# EAGLE schematic 7SEG_STATUS_1 (EAGLE 6.5.0)

## Sheet 1 of 9
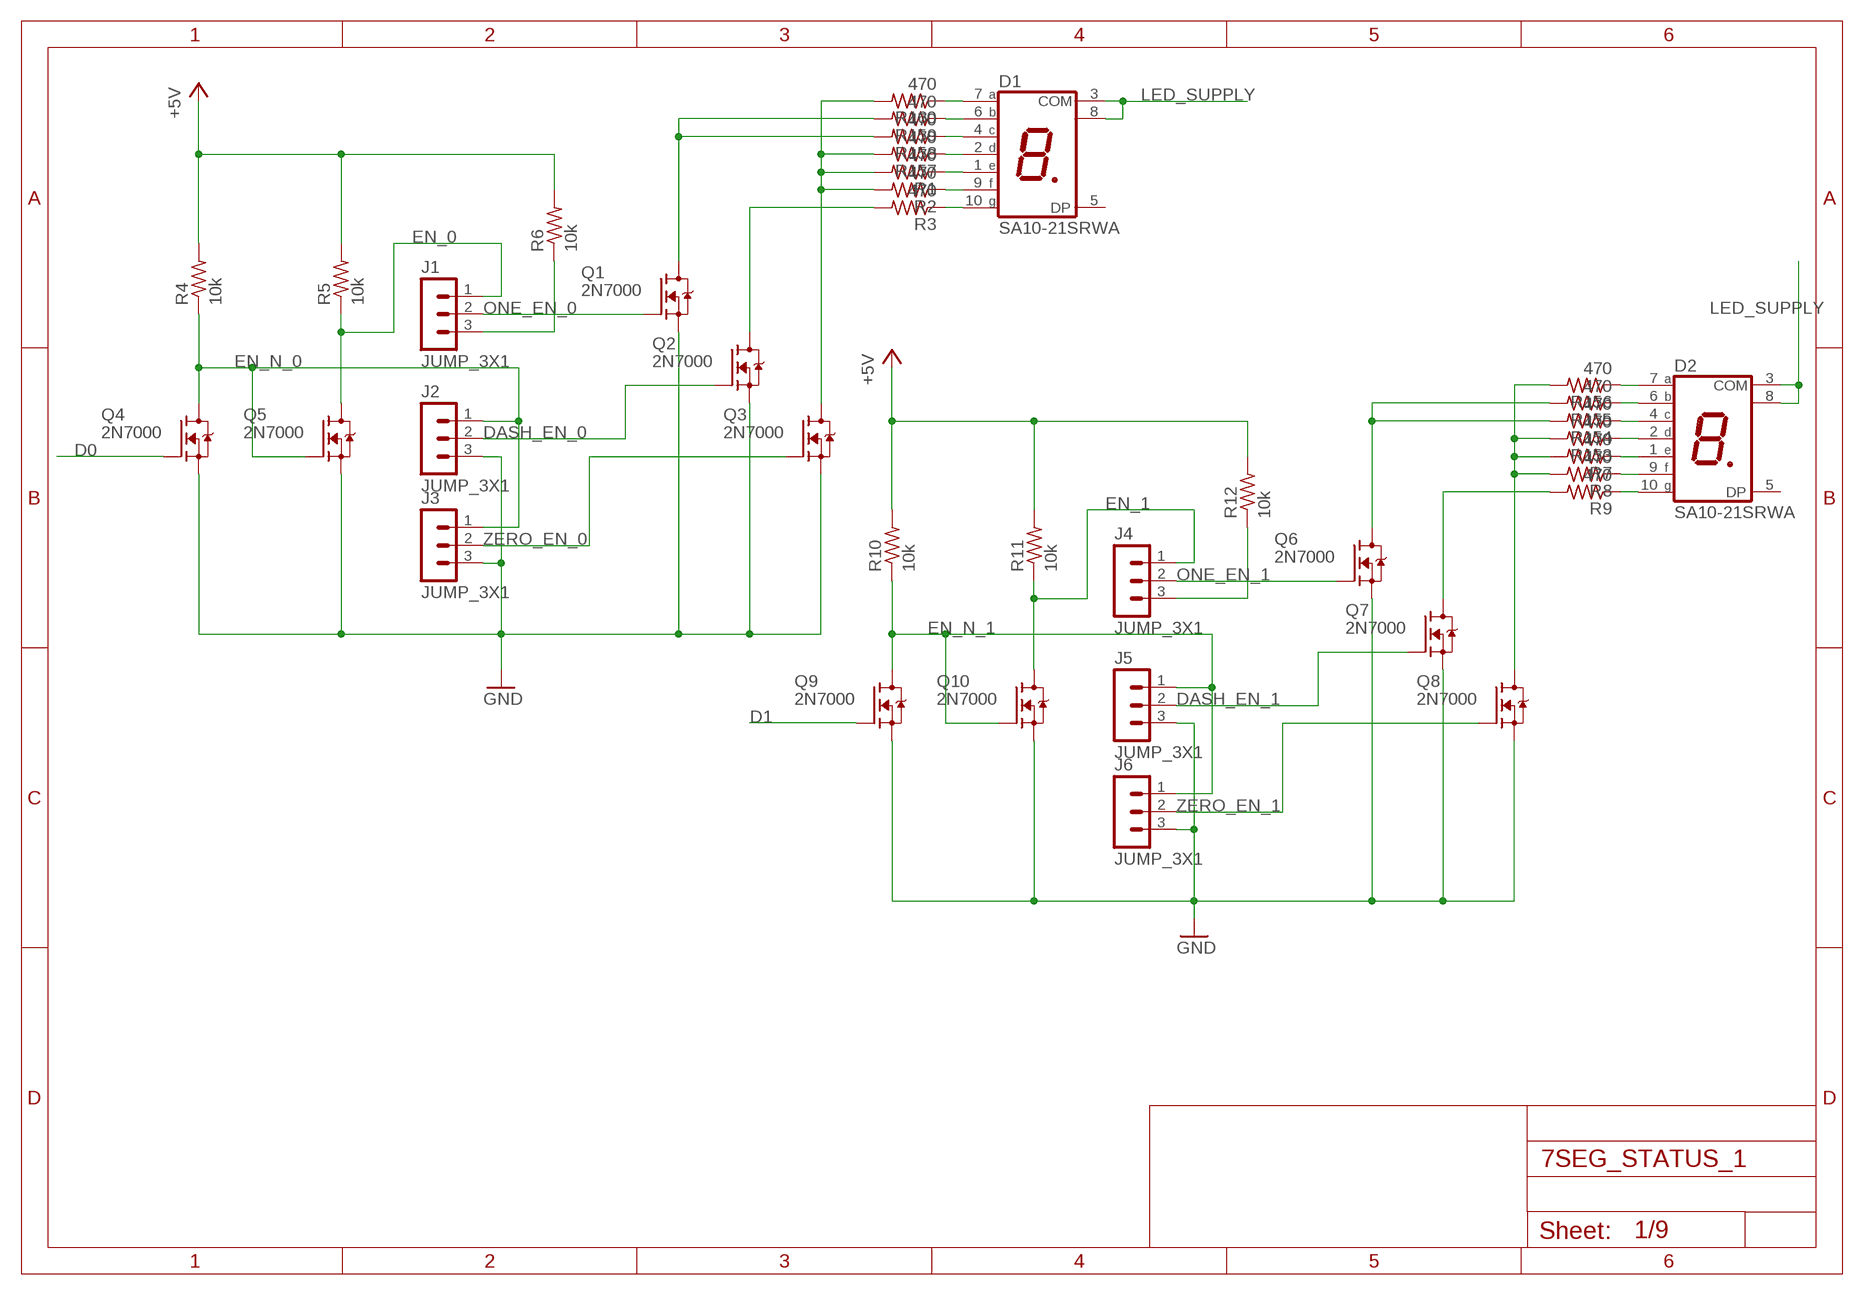
[diagram p0: schematic, sheet 1]

### Parts
D1  SA10-21SRWA  [SA10]
D2  SA10-21SRWA  [SA10]
J1  JUMP_3X1  [JUMP_3X1]
J2  JUMP_3X1  [JUMP_3X1]
J3  JUMP_3X1  [JUMP_3X1]
J4  JUMP_3X1  [JUMP_3X1]
J5  JUMP_3X1  [JUMP_3X1]
J6  JUMP_3X1  [JUMP_3X1]
Q1  2N7000  [TO92-DGS]
Q2  2N7000  [TO92-DGS]
Q3  2N7000  [TO92-DGS]
Q4  2N7000  [TO92-DGS]
Q5  2N7000  [TO92-DGS]
Q6  2N7000  [TO92-DGS]
Q7  2N7000  [TO92-DGS]
Q8  2N7000  [TO92-DGS]
Q9  2N7000  [TO92-DGS]
Q10  2N7000  [TO92-DGS]
R1  470  R_P2INCH  [R_P2INCH]
R2  470  R_P2INCH  [R_P2INCH]
R3  470  R_P2INCH  [R_P2INCH]
R4  10k  R_P2INCH  [R_P2INCH]
R5  10k  R_P2INCH  [R_P2INCH]
R6  10k  R_P2INCH  [R_P2INCH]
R7  470  R_P2INCH  [R_P2INCH]
R8  470  R_P2INCH  [R_P2INCH]
R9  470  R_P2INCH  [R_P2INCH]
R10  10k  R_P2INCH  [R_P2INCH]
R11  10k  R_P2INCH  [R_P2INCH]
R12  10k  R_P2INCH  [R_P2INCH]
R153  470  R_P2INCH  [R_P2INCH]
R154  470  R_P2INCH  [R_P2INCH]
R155  470  R_P2INCH  [R_P2INCH]
R156  470  R_P2INCH  [R_P2INCH]
R157  470  R_P2INCH  [R_P2INCH]
R158  470  R_P2INCH  [R_P2INCH]
R159  470  R_P2INCH  [R_P2INCH]
R160  470  R_P2INCH  [R_P2INCH]

### Nets
+5V: R4.2 R5.2 R6.2 R10.2 R11.2 R12.2 ; also sheet 2,3,4,5,6,7,8,9
D0: Q4.G ; also sheet 9
D1: Q9.G ; also sheet 9
DASH_EN_0: J2.2 Q2.G
DASH_EN_1: J5.2 Q7.G
EN_0: J1.1 Q5.D R5.1
EN_1: J4.1 Q10.D R11.1
EN_N_0: J2.1 J3.1 Q4.D Q5.G R4.1
EN_N_1: J5.1 J6.1 Q9.D Q10.G R10.1
GND: J2.3 J3.3 J5.3 J6.3 Q1.S Q2.S Q3.S Q4.S Q5.S Q6.S Q7.S Q8.S Q9.S Q10.S ; also sheet 2,3,4,5,6,7,8,9
LED_SUPPLY: D1.3(COM) D1.8(COM) D2.3(COM) D2.8(COM) ; also sheet 2,3,4,5,6,7,8,9
N$1: D2.7(A) R156.1
N$3: D2.6(B) R155.1
N$4: D2.4(C) R154.1
N$5: D2.2(D) R153.1
N$6: D1.7(A) R160.1
N$7: D2.1(E) R7.1
N$8: D2.9(F) R8.1
N$9: J4.3 R12.1
N$10: J1.3 R6.1
N$11: D2.10(G) R9.1
N$166: Q7.D R9.2
N$167: Q6.D R154.2 R155.2
N$168: Q8.D R7.2 R8.2 R153.2 R156.2
N$169: D1.6(B) R159.1
N$170: D1.4(C) R158.1
N$171: D1.2(D) R157.1
N$172: D1.1(E) R1.1
N$173: D1.9(F) R2.1
N$174: D1.10(G) R3.1
N$175: Q2.D R3.2
N$176: Q1.D R158.2 R159.2
N$177: Q3.D R1.2 R2.2 R157.2 R160.2
ONE_EN_0: J1.2 Q1.G
ONE_EN_1: J4.2 Q6.G
ZERO_EN_0: J3.2 Q3.G
ZERO_EN_1: J6.2 Q8.G
Unconnected: D1.5(DP) D2.5(DP)

## Sheet 2 of 9
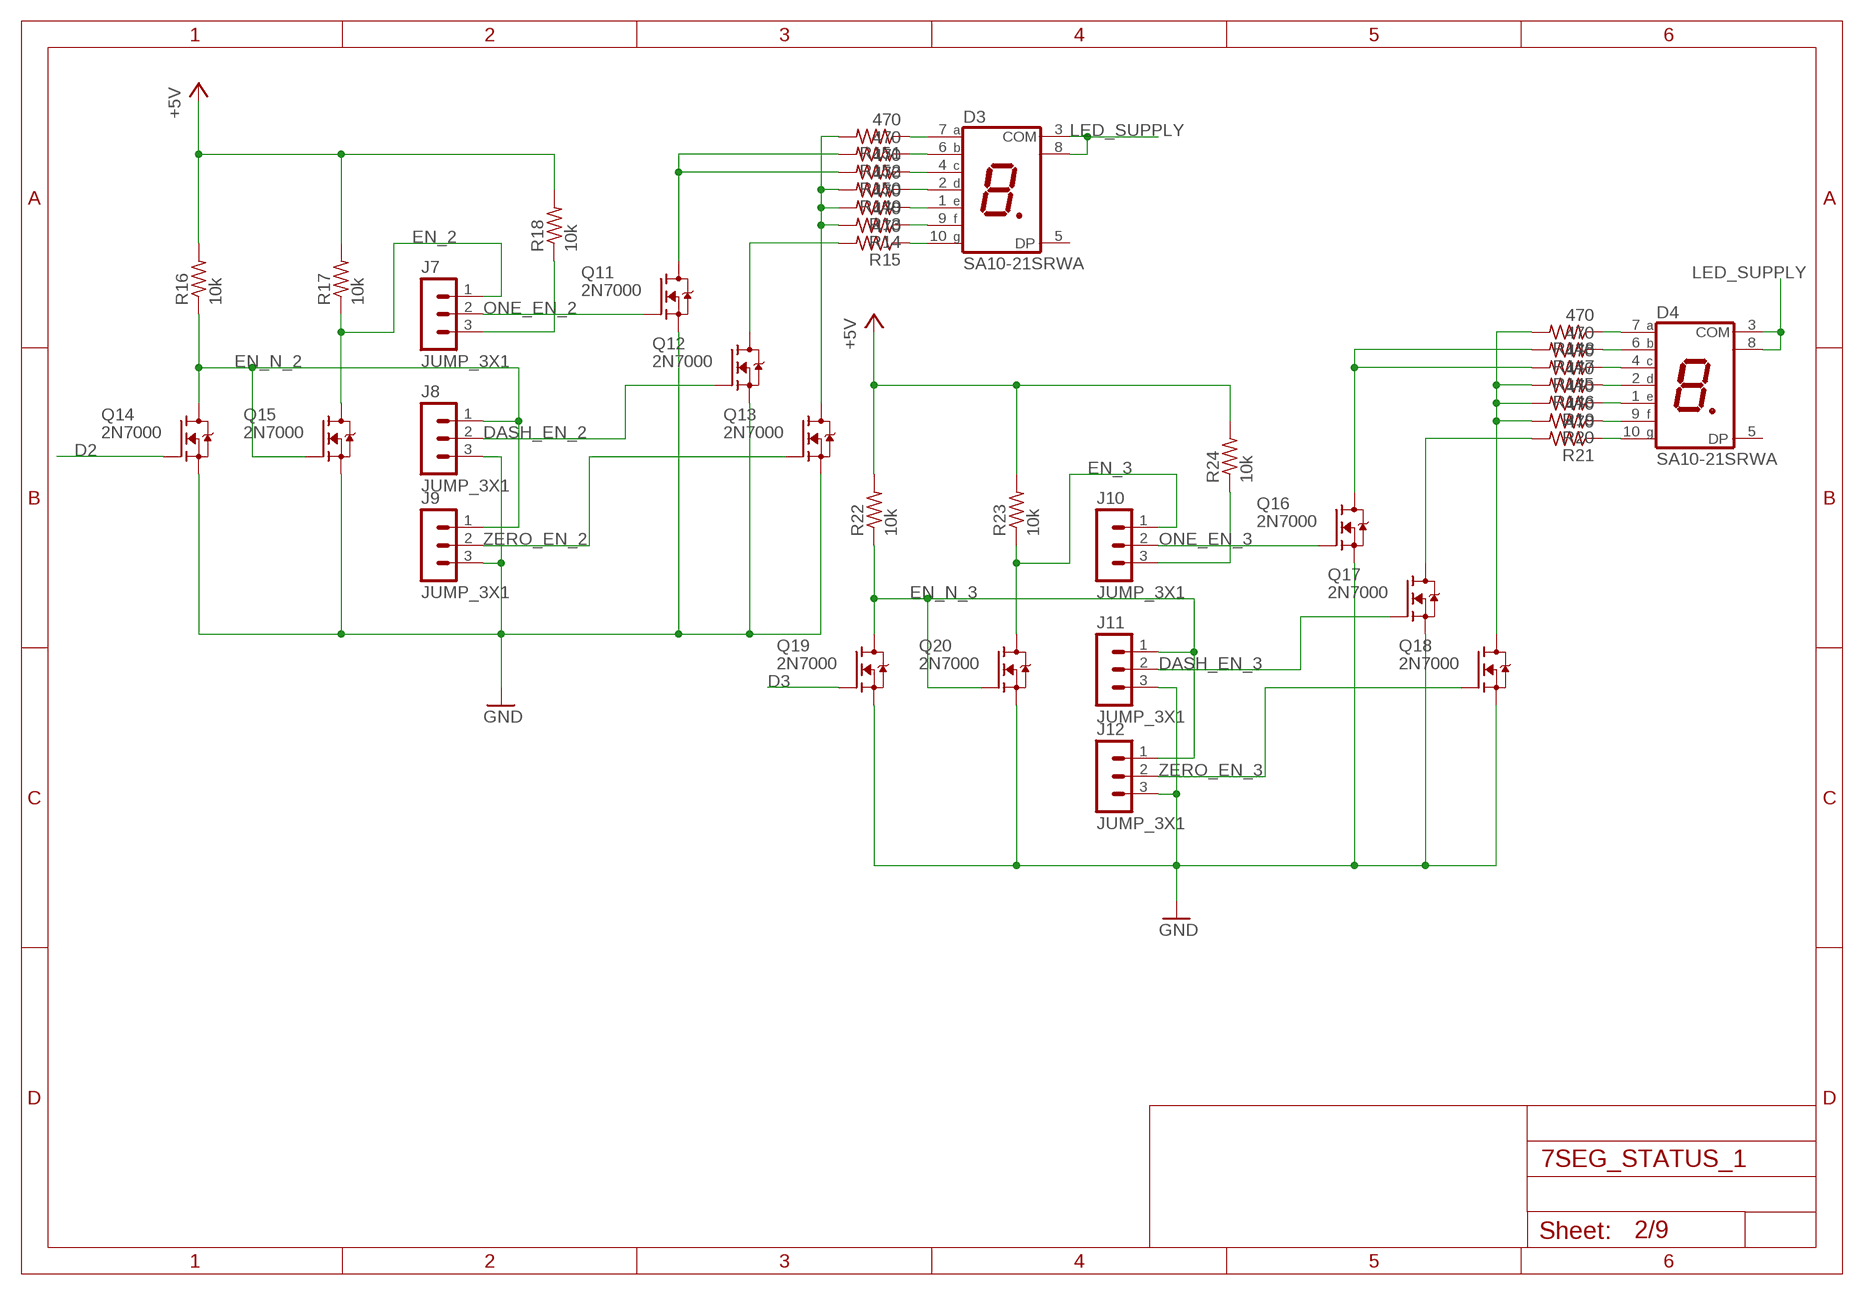
[diagram p1: schematic, sheet 2]

### Parts
D3  SA10-21SRWA  [SA10]
D4  SA10-21SRWA  [SA10]
J7  JUMP_3X1  [JUMP_3X1]
J8  JUMP_3X1  [JUMP_3X1]
J9  JUMP_3X1  [JUMP_3X1]
J10  JUMP_3X1  [JUMP_3X1]
J11  JUMP_3X1  [JUMP_3X1]
J12  JUMP_3X1  [JUMP_3X1]
Q11  2N7000  [TO92-DGS]
Q12  2N7000  [TO92-DGS]
Q13  2N7000  [TO92-DGS]
Q14  2N7000  [TO92-DGS]
Q15  2N7000  [TO92-DGS]
Q16  2N7000  [TO92-DGS]
Q17  2N7000  [TO92-DGS]
Q18  2N7000  [TO92-DGS]
Q19  2N7000  [TO92-DGS]
Q20  2N7000  [TO92-DGS]
R13  470  R_P2INCH  [R_P2INCH]
R14  470  R_P2INCH  [R_P2INCH]
R15  470  R_P2INCH  [R_P2INCH]
R16  10k  R_P2INCH  [R_P2INCH]
R17  10k  R_P2INCH  [R_P2INCH]
R18  10k  R_P2INCH  [R_P2INCH]
R19  470  R_P2INCH  [R_P2INCH]
R20  470  R_P2INCH  [R_P2INCH]
R21  470  R_P2INCH  [R_P2INCH]
R22  10k  R_P2INCH  [R_P2INCH]
R23  10k  R_P2INCH  [R_P2INCH]
R24  10k  R_P2INCH  [R_P2INCH]
R145  470  R_P2INCH  [R_P2INCH]
R146  470  R_P2INCH  [R_P2INCH]
R147  470  R_P2INCH  [R_P2INCH]
R148  470  R_P2INCH  [R_P2INCH]
R149  470  R_P2INCH  [R_P2INCH]
R150  470  R_P2INCH  [R_P2INCH]
R151  470  R_P2INCH  [R_P2INCH]
R152  470  R_P2INCH  [R_P2INCH]

### Nets
+5V: R16.2 R17.2 R18.2 R22.2 R23.2 R24.2 ; also sheet 1,3,4,5,6,7,8,9
D2: Q14.G ; also sheet 9
D3: Q19.G ; also sheet 9
DASH_EN_2: J8.2 Q12.G
DASH_EN_3: J11.2 Q17.G
EN_2: J7.1 Q15.D R17.1
EN_3: J10.1 Q20.D R23.1
EN_N_2: J8.1 J9.1 Q14.D Q15.G R16.1
EN_N_3: J11.1 J12.1 Q19.D Q20.G R22.1
GND: J8.3 J9.3 J11.3 J12.3 Q11.S Q12.S Q13.S Q14.S Q15.S Q16.S Q17.S Q18.S Q19.S Q20.S ; also sheet 1,3,4,5,6,7,8,9
LED_SUPPLY: D3.3(COM) D3.8(COM) D4.3(COM) D4.8(COM) ; also sheet 1,3,4,5,6,7,8,9
N$12: D3.7(A) R151.1
N$13: D4.7(A) R148.1
N$14: D4.6(B) R147.1
N$15: J7.3 R18.1
N$16: D4.4(C) R145.1
N$17: D4.2(D) R146.1
N$18: D4.1(E) R19.1
N$19: D4.9(F) R20.1
N$20: J10.3 R24.1
N$153: D4.10(G) R21.1
N$154: Q17.D R21.2
N$155: Q16.D R145.2 R147.2
N$156: Q18.D R19.2 R20.2 R146.2 R148.2
N$157: D3.6(B) R152.1
N$158: D3.4(C) R150.1
N$159: D3.2(D) R149.1
N$160: D3.1(E) R13.1
N$161: D3.9(F) R14.1
N$162: D3.10(G) R15.1
N$163: Q12.D R15.2
N$164: Q11.D R150.2 R152.2
N$165: Q13.D R13.2 R14.2 R149.2 R151.2
ONE_EN_2: J7.2 Q11.G
ONE_EN_3: J10.2 Q16.G
ZERO_EN_2: J9.2 Q13.G
ZERO_EN_3: J12.2 Q18.G
Unconnected: D3.5(DP) D4.5(DP)

## Sheet 3 of 9
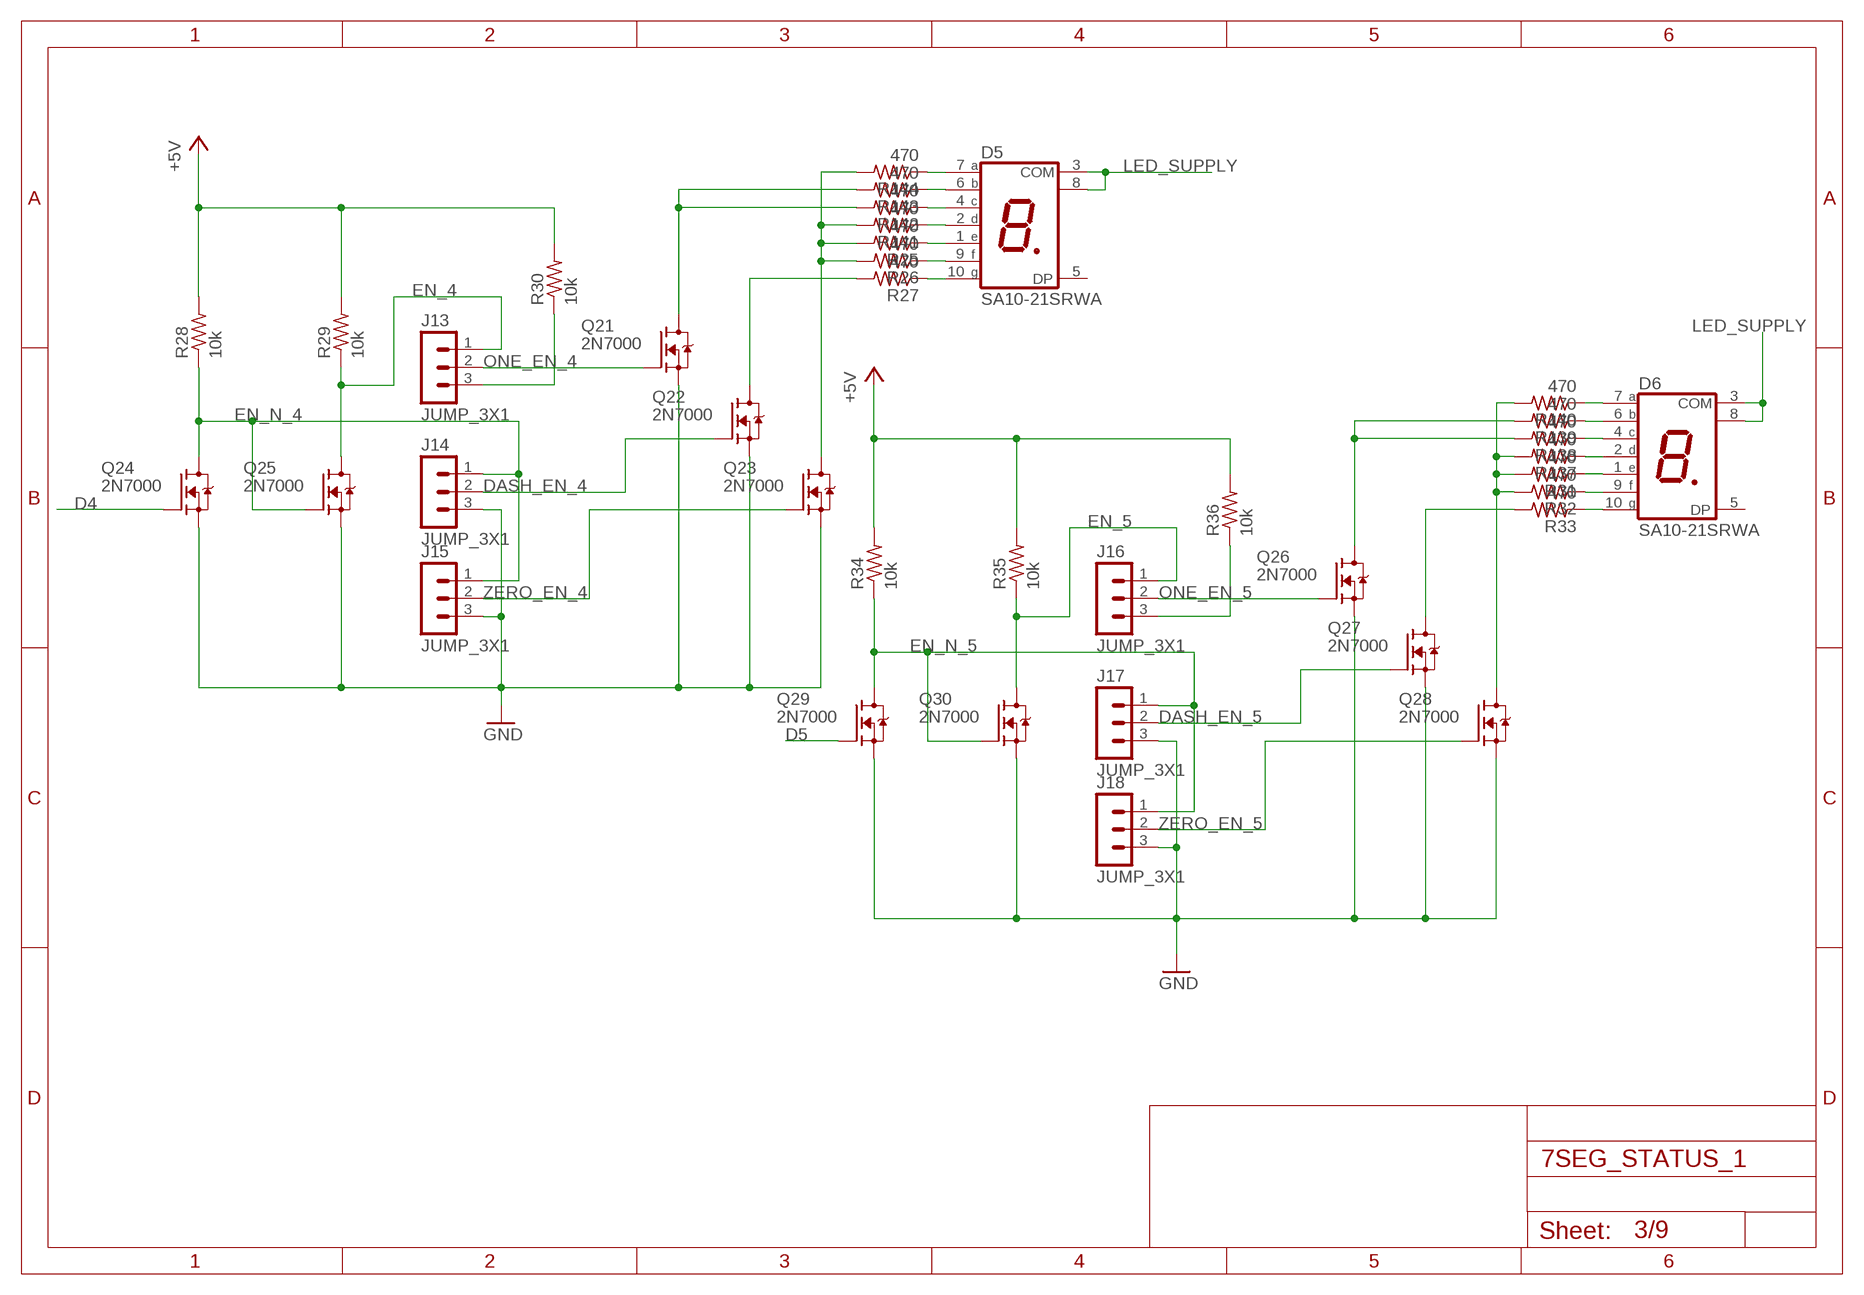
[diagram p2: schematic, sheet 3]

### Parts
D5  SA10-21SRWA  [SA10]
D6  SA10-21SRWA  [SA10]
J13  JUMP_3X1  [JUMP_3X1]
J14  JUMP_3X1  [JUMP_3X1]
J15  JUMP_3X1  [JUMP_3X1]
J16  JUMP_3X1  [JUMP_3X1]
J17  JUMP_3X1  [JUMP_3X1]
J18  JUMP_3X1  [JUMP_3X1]
Q21  2N7000  [TO92-DGS]
Q22  2N7000  [TO92-DGS]
Q23  2N7000  [TO92-DGS]
Q24  2N7000  [TO92-DGS]
Q25  2N7000  [TO92-DGS]
Q26  2N7000  [TO92-DGS]
Q27  2N7000  [TO92-DGS]
Q28  2N7000  [TO92-DGS]
Q29  2N7000  [TO92-DGS]
Q30  2N7000  [TO92-DGS]
R25  470  R_P2INCH  [R_P2INCH]
R26  470  R_P2INCH  [R_P2INCH]
R27  470  R_P2INCH  [R_P2INCH]
R28  10k  R_P2INCH  [R_P2INCH]
R29  10k  R_P2INCH  [R_P2INCH]
R30  10k  R_P2INCH  [R_P2INCH]
R31  470  R_P2INCH  [R_P2INCH]
R32  470  R_P2INCH  [R_P2INCH]
R33  470  R_P2INCH  [R_P2INCH]
R34  10k  R_P2INCH  [R_P2INCH]
R35  10k  R_P2INCH  [R_P2INCH]
R36  10k  R_P2INCH  [R_P2INCH]
R137  470  R_P2INCH  [R_P2INCH]
R138  470  R_P2INCH  [R_P2INCH]
R139  470  R_P2INCH  [R_P2INCH]
R140  470  R_P2INCH  [R_P2INCH]
R141  470  R_P2INCH  [R_P2INCH]
R142  470  R_P2INCH  [R_P2INCH]
R143  470  R_P2INCH  [R_P2INCH]
R144  470  R_P2INCH  [R_P2INCH]

### Nets
+5V: R28.2 R29.2 R30.2 R34.2 R35.2 R36.2 ; also sheet 1,2,4,5,6,7,8,9
D4: Q24.G ; also sheet 9
D5: Q29.G ; also sheet 9
DASH_EN_4: J14.2 Q22.G
DASH_EN_5: J17.2 Q27.G
EN_4: J13.1 Q25.D R29.1
EN_5: J16.1 Q30.D R35.1
EN_N_4: J14.1 J15.1 Q24.D Q25.G R28.1
EN_N_5: J17.1 J18.1 Q29.D Q30.G R34.1
GND: J14.3 J15.3 J17.3 J18.3 Q21.S Q22.S Q23.S Q24.S Q25.S Q26.S Q27.S Q28.S Q29.S Q30.S ; also sheet 1,2,4,5,6,7,8,9
LED_SUPPLY: D5.3(COM) D5.8(COM) D6.3(COM) D6.8(COM) ; also sheet 1,2,4,5,6,7,8,9
N$21: Q22.D R27.2
N$22: D6.7(A) R140.1
N$23: D6.6(B) R139.1
N$24: D6.4(C) R138.1
N$25: J13.3 R30.1
N$26: D6.2(D) R137.1
N$27: D6.1(E) R31.1
N$28: D6.9(F) R32.1
N$29: Q21.D R142.2 R143.2
N$30: J16.3 R36.1
N$141: D6.10(G) R33.1
N$142: Q26.D R138.2 R139.2
N$143: Q27.D R33.2
N$144: Q28.D R31.2 R32.2 R137.2 R140.2
N$145: Q23.D R25.2 R26.2 R141.2 R144.2
N$146: D5.7(A) R144.1
N$147: D5.6(B) R143.1
N$148: D5.4(C) R142.1
N$149: D5.2(D) R141.1
N$150: D5.1(E) R25.1
N$151: D5.9(F) R26.1
N$152: D5.10(G) R27.1
ONE_EN_4: J13.2 Q21.G
ONE_EN_5: J16.2 Q26.G
ZERO_EN_4: J15.2 Q23.G
ZERO_EN_5: J18.2 Q28.G
Unconnected: D5.5(DP) D6.5(DP)

## Sheet 4 of 9
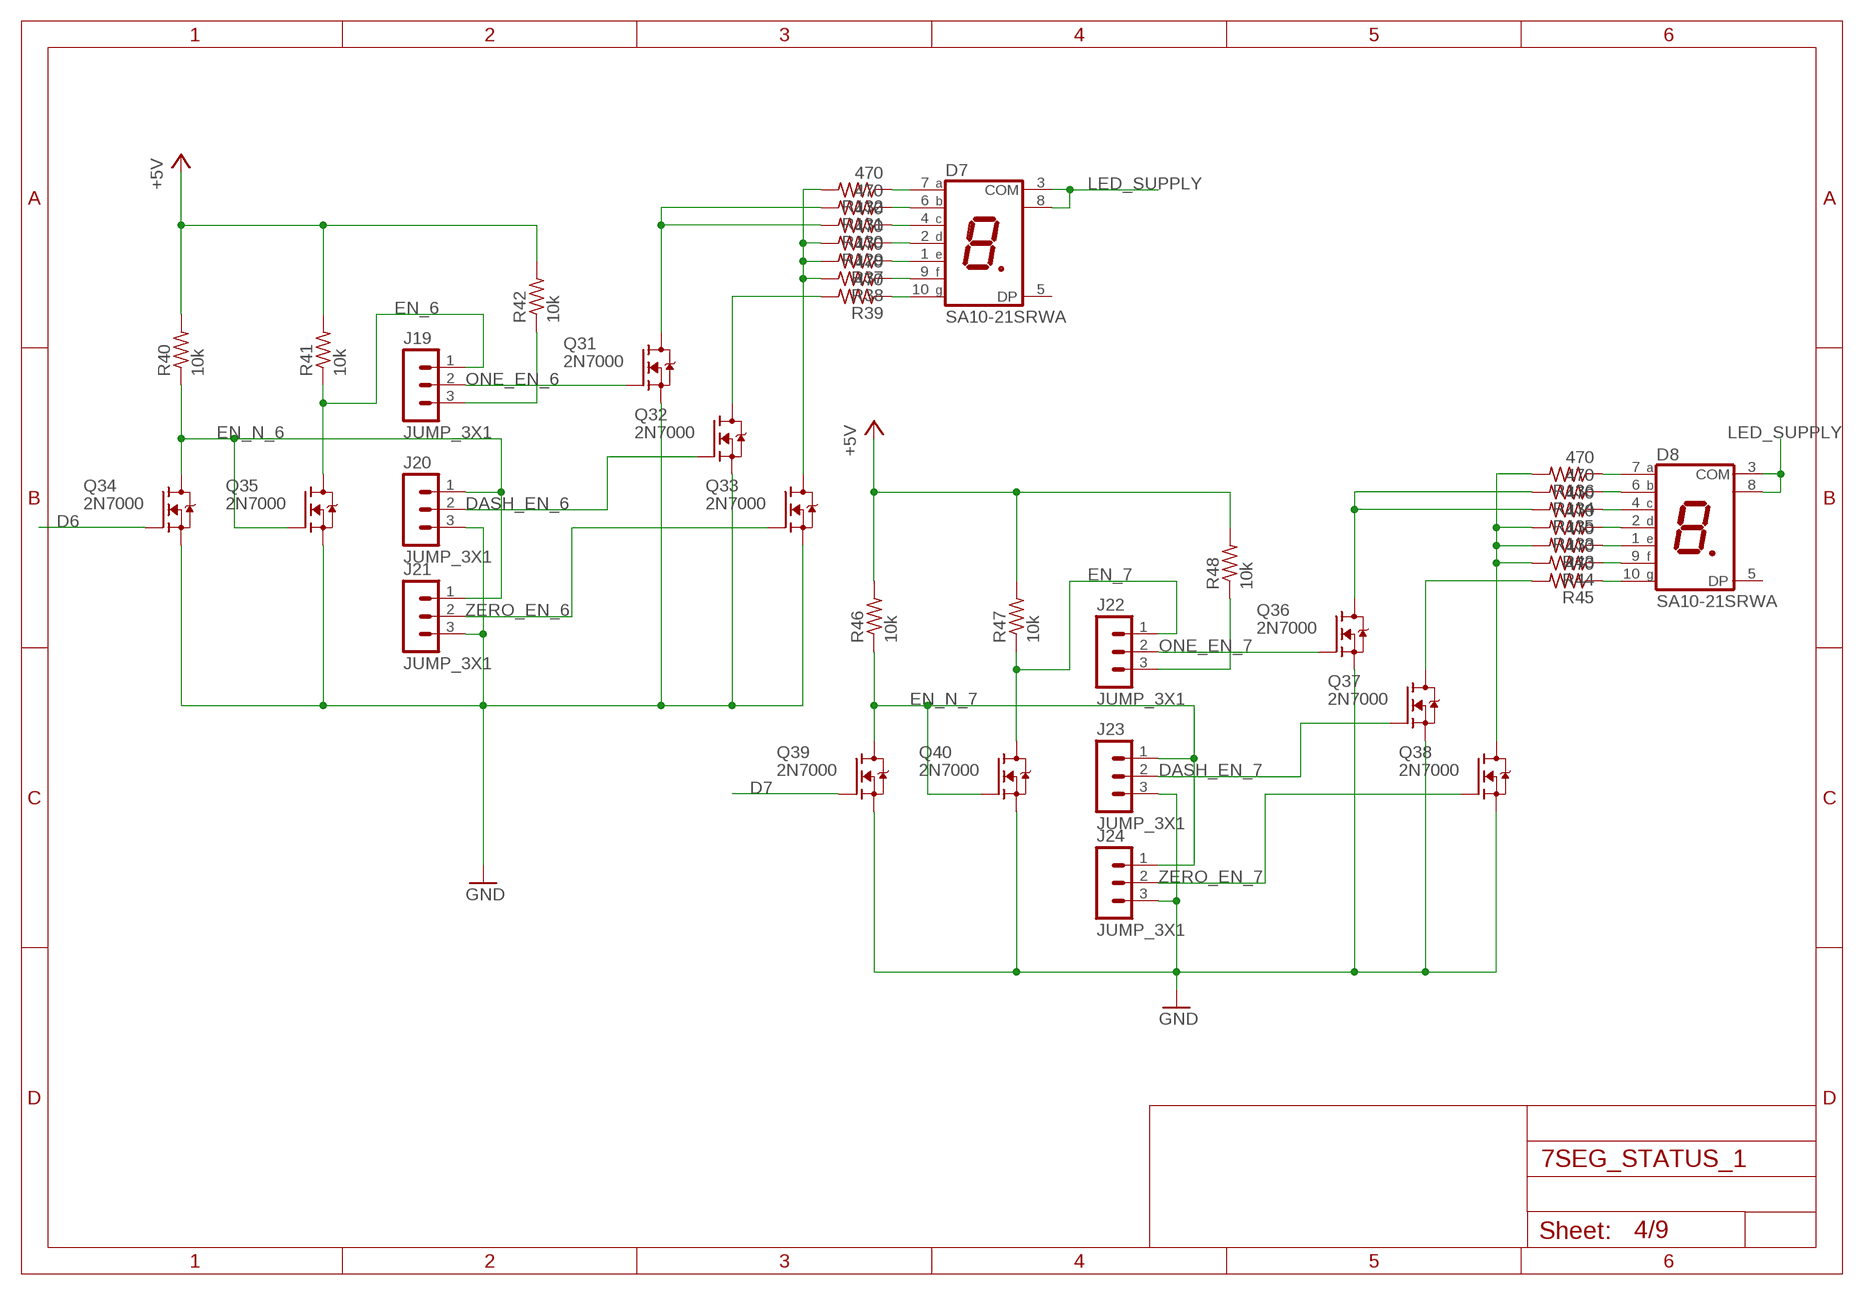
[diagram p3: schematic, sheet 4]

### Parts
D7  SA10-21SRWA  [SA10]
D8  SA10-21SRWA  [SA10]
J19  JUMP_3X1  [JUMP_3X1]
J20  JUMP_3X1  [JUMP_3X1]
J21  JUMP_3X1  [JUMP_3X1]
J22  JUMP_3X1  [JUMP_3X1]
J23  JUMP_3X1  [JUMP_3X1]
J24  JUMP_3X1  [JUMP_3X1]
Q31  2N7000  [TO92-DGS]
Q32  2N7000  [TO92-DGS]
Q33  2N7000  [TO92-DGS]
Q34  2N7000  [TO92-DGS]
Q35  2N7000  [TO92-DGS]
Q36  2N7000  [TO92-DGS]
Q37  2N7000  [TO92-DGS]
Q38  2N7000  [TO92-DGS]
Q39  2N7000  [TO92-DGS]
Q40  2N7000  [TO92-DGS]
R37  470  R_P2INCH  [R_P2INCH]
R38  470  R_P2INCH  [R_P2INCH]
R39  470  R_P2INCH  [R_P2INCH]
R40  10k  R_P2INCH  [R_P2INCH]
R41  10k  R_P2INCH  [R_P2INCH]
R42  10k  R_P2INCH  [R_P2INCH]
R43  470  R_P2INCH  [R_P2INCH]
R44  470  R_P2INCH  [R_P2INCH]
R45  470  R_P2INCH  [R_P2INCH]
R46  10k  R_P2INCH  [R_P2INCH]
R47  10k  R_P2INCH  [R_P2INCH]
R48  10k  R_P2INCH  [R_P2INCH]
R129  470  R_P2INCH  [R_P2INCH]
R130  470  R_P2INCH  [R_P2INCH]
R131  470  R_P2INCH  [R_P2INCH]
R132  470  R_P2INCH  [R_P2INCH]
R133  470  R_P2INCH  [R_P2INCH]
R134  470  R_P2INCH  [R_P2INCH]
R135  470  R_P2INCH  [R_P2INCH]
R136  470  R_P2INCH  [R_P2INCH]

### Nets
+5V: R40.2 R41.2 R42.2 R46.2 R47.2 R48.2 ; also sheet 1,2,3,5,6,7,8,9
D6: Q34.G ; also sheet 9
D7: Q39.G ; also sheet 9
DASH_EN_6: J20.2 Q32.G
DASH_EN_7: J23.2 Q37.G
EN_6: J19.1 Q35.D R41.1
EN_7: J22.1 Q40.D R47.1
EN_N_6: J20.1 J21.1 Q34.D Q35.G R40.1
EN_N_7: J23.1 J24.1 Q39.D Q40.G R46.1
GND: J20.3 J21.3 J23.3 J24.3 Q31.S Q32.S Q33.S Q34.S Q35.S Q36.S Q37.S Q38.S Q39.S Q40.S ; also sheet 1,2,3,5,6,7,8,9
LED_SUPPLY: D7.3(COM) D7.8(COM) D8.3(COM) D8.8(COM) ; also sheet 1,2,3,5,6,7,8,9
N$31: D7.7(A) R132.1
N$32: D7.6(B) R131.1
N$33: D7.4(C) R130.1
N$34: D7.2(D) R129.1
N$35: J19.3 R42.1
N$36: D7.1(E) R37.1
N$37: D7.9(F) R38.1
N$38: D7.10(G) R39.1
N$39: D8.7(A) R136.1
N$40: J22.3 R48.1
N$41: Q32.D R39.2
N$130: Q31.D R130.2 R131.2
N$131: D8.6(B) R134.1
N$132: D8.4(C) R135.1
N$133: D8.2(D) R133.1
N$134: D8.1(E) R43.1
N$135: D8.9(F) R44.1
N$136: D8.10(G) R45.1
N$137: Q37.D R45.2
N$138: Q36.D R134.2 R135.2
N$139: Q38.D R43.2 R44.2 R133.2 R136.2
N$140: Q33.D R37.2 R38.2 R129.2 R132.2
ONE_EN_6: J19.2 Q31.G
ONE_EN_7: J22.2 Q36.G
ZERO_EN_6: J21.2 Q33.G
ZERO_EN_7: J24.2 Q38.G
Unconnected: D7.5(DP) D8.5(DP)

## Sheet 5 of 9
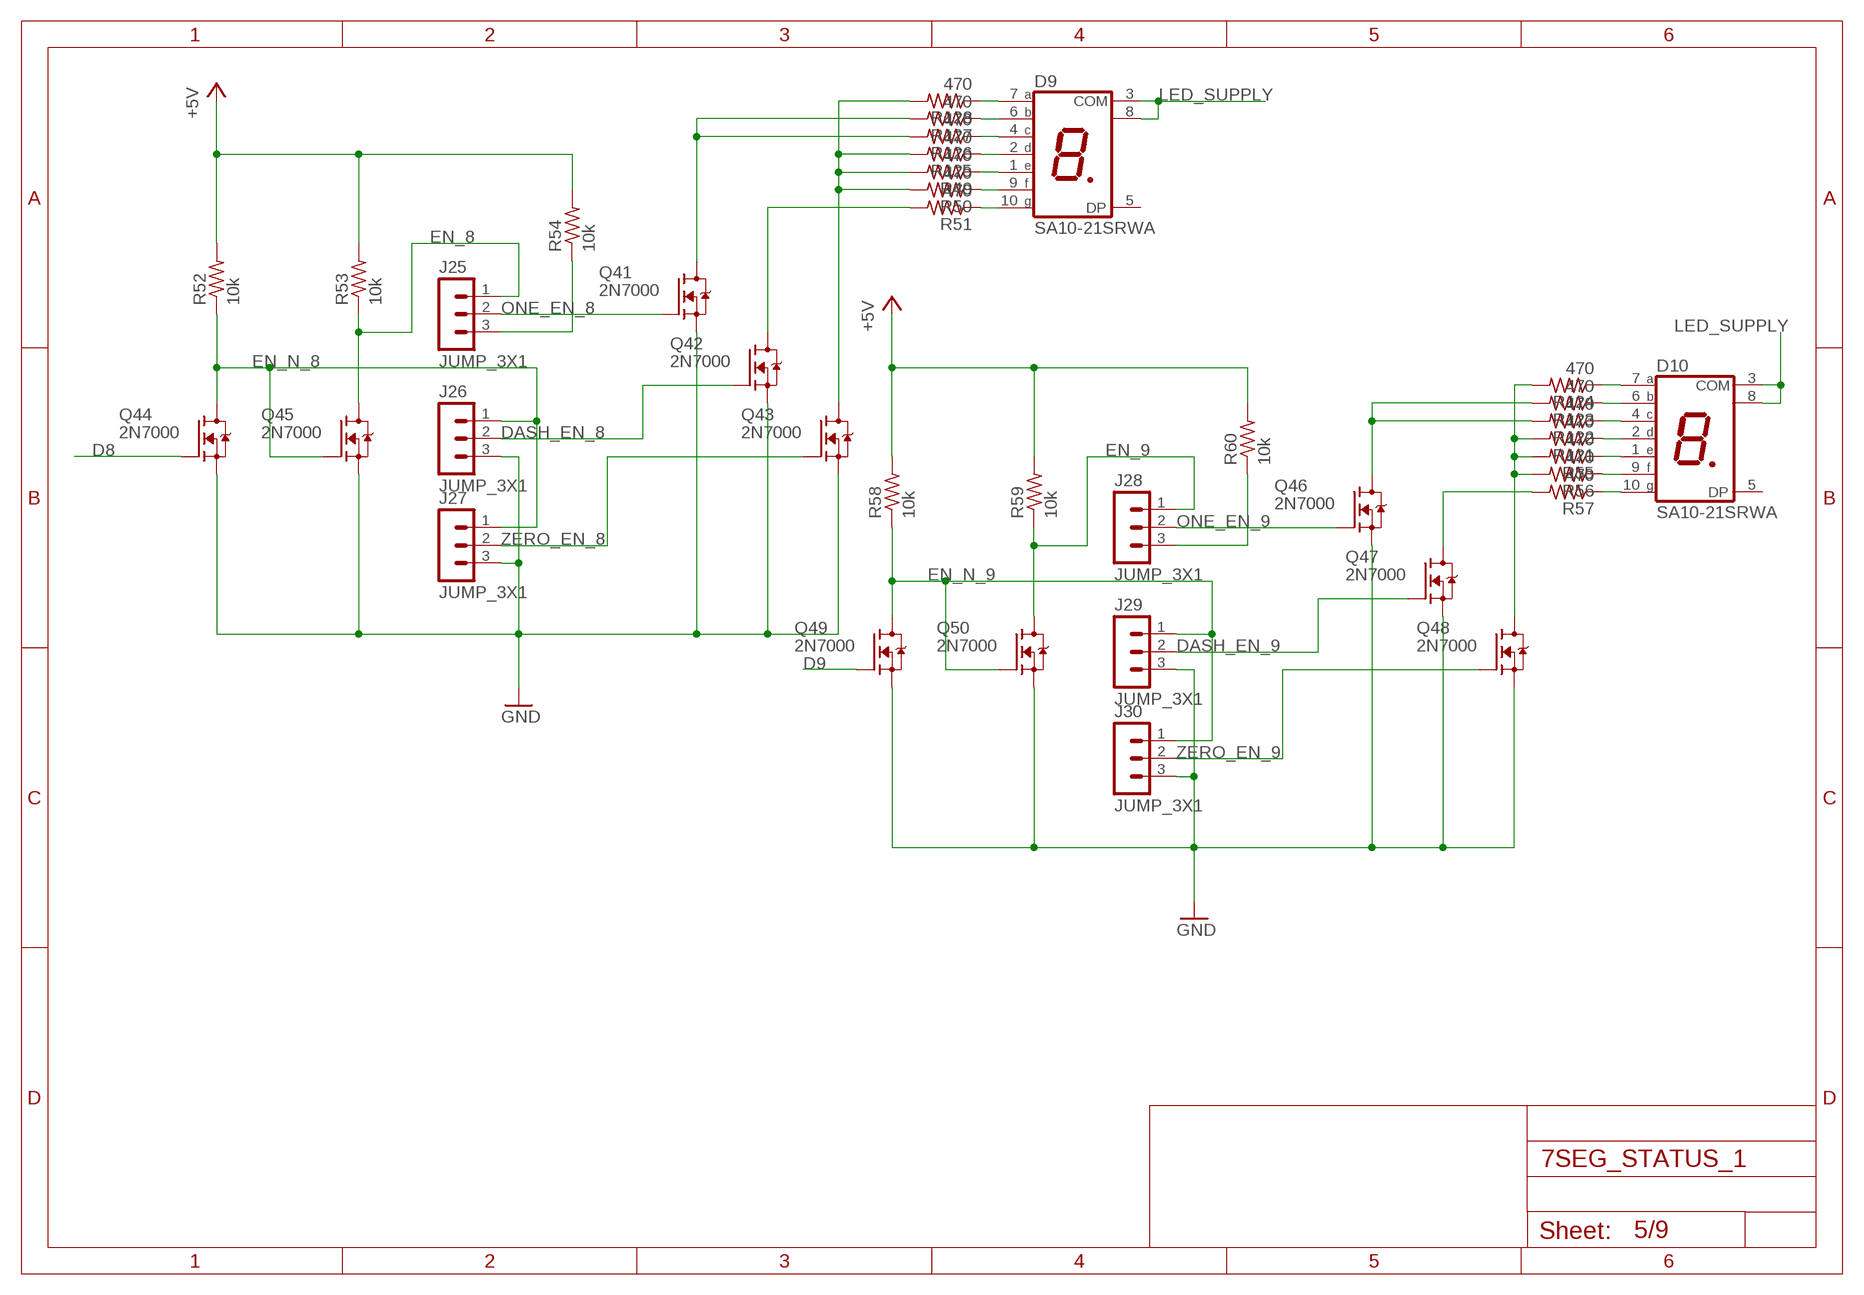
[diagram p4: schematic, sheet 5]

### Parts
D9  SA10-21SRWA  [SA10]
D10  SA10-21SRWA  [SA10]
J25  JUMP_3X1  [JUMP_3X1]
J26  JUMP_3X1  [JUMP_3X1]
J27  JUMP_3X1  [JUMP_3X1]
J28  JUMP_3X1  [JUMP_3X1]
J29  JUMP_3X1  [JUMP_3X1]
J30  JUMP_3X1  [JUMP_3X1]
Q41  2N7000  [TO92-DGS]
Q42  2N7000  [TO92-DGS]
Q43  2N7000  [TO92-DGS]
Q44  2N7000  [TO92-DGS]
Q45  2N7000  [TO92-DGS]
Q46  2N7000  [TO92-DGS]
Q47  2N7000  [TO92-DGS]
Q48  2N7000  [TO92-DGS]
Q49  2N7000  [TO92-DGS]
Q50  2N7000  [TO92-DGS]
R49  470  R_P2INCH  [R_P2INCH]
R50  470  R_P2INCH  [R_P2INCH]
R51  470  R_P2INCH  [R_P2INCH]
R52  10k  R_P2INCH  [R_P2INCH]
R53  10k  R_P2INCH  [R_P2INCH]
R54  10k  R_P2INCH  [R_P2INCH]
R55  470  R_P2INCH  [R_P2INCH]
R56  470  R_P2INCH  [R_P2INCH]
R57  470  R_P2INCH  [R_P2INCH]
R58  10k  R_P2INCH  [R_P2INCH]
R59  10k  R_P2INCH  [R_P2INCH]
R60  10k  R_P2INCH  [R_P2INCH]
R121  470  R_P2INCH  [R_P2INCH]
R122  470  R_P2INCH  [R_P2INCH]
R123  470  R_P2INCH  [R_P2INCH]
R124  470  R_P2INCH  [R_P2INCH]
R125  470  R_P2INCH  [R_P2INCH]
R126  470  R_P2INCH  [R_P2INCH]
R127  470  R_P2INCH  [R_P2INCH]
R128  470  R_P2INCH  [R_P2INCH]

### Nets
+5V: R52.2 R53.2 R54.2 R58.2 R59.2 R60.2 ; also sheet 1,2,3,4,6,7,8,9
D8: Q44.G ; also sheet 9
D9: Q49.G ; also sheet 9
DASH_EN_8: J26.2 Q42.G
DASH_EN_9: J29.2 Q47.G
EN_8: J25.1 Q45.D R53.1
EN_9: J28.1 Q50.D R59.1
EN_N_8: J26.1 J27.1 Q44.D Q45.G R52.1
EN_N_9: J29.1 J30.1 Q49.D Q50.G R58.1
GND: J26.3 J27.3 J29.3 J30.3 Q41.S Q42.S Q43.S Q44.S Q45.S Q46.S Q47.S Q48.S Q49.S Q50.S ; also sheet 1,2,3,4,6,7,8,9
LED_SUPPLY: D9.3(COM) D9.8(COM) D10.3(COM) D10.8(COM) ; also sheet 1,2,3,4,6,7,8,9
N$42: D9.7(A) R128.1
N$43: D10.10(G) R57.1
N$44: D10.9(F) R56.1
N$45: J25.3 R54.1
N$46: D10.1(E) R55.1
N$47: D10.2(D) R121.1
N$48: D10.4(C) R122.1
N$49: D10.6(B) R123.1
N$50: J28.3 R60.1
N$105: D10.7(A) R124.1
N$118: Q47.D R57.2
N$119: Q46.D R122.2 R123.2
N$120: Q48.D R55.2 R56.2 R121.2 R124.2
N$121: D9.6(B) R127.1
N$122: D9.4(C) R126.1
N$123: D9.2(D) R125.1
N$124: D9.1(E) R49.1
N$125: D9.9(F) R50.1
N$126: D9.10(G) R51.1
N$127: Q42.D R51.2
N$128: Q41.D R126.2 R127.2
N$129: Q43.D R49.2 R50.2 R125.2 R128.2
ONE_EN_8: J25.2 Q41.G
ONE_EN_9: J28.2 Q46.G
ZERO_EN_8: J27.2 Q43.G
ZERO_EN_9: J30.2 Q48.G
Unconnected: D9.5(DP) D10.5(DP)

## Sheet 6 of 9
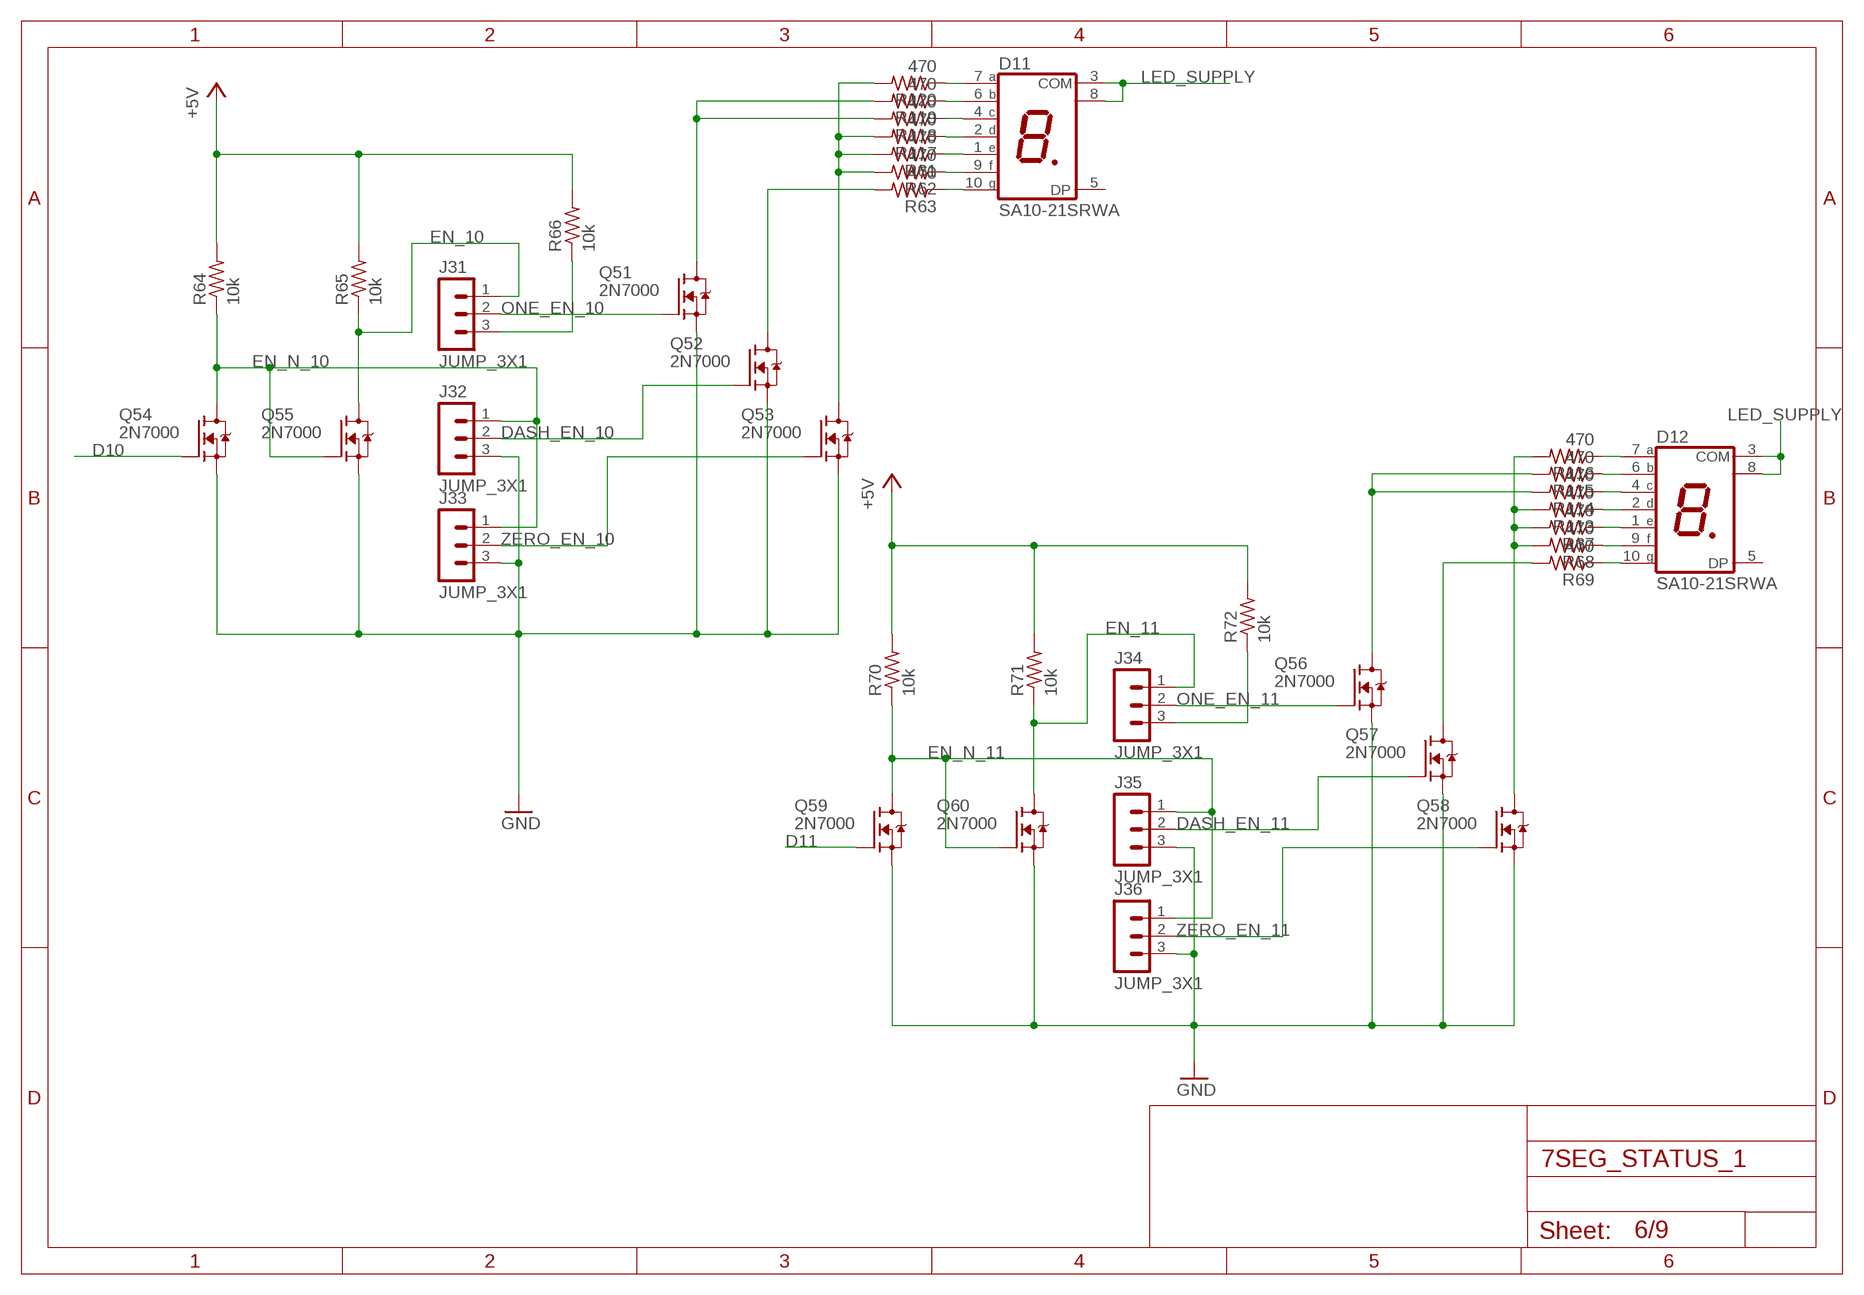
[diagram p5: schematic, sheet 6]

### Parts
D11  SA10-21SRWA  [SA10]
D12  SA10-21SRWA  [SA10]
J31  JUMP_3X1  [JUMP_3X1]
J32  JUMP_3X1  [JUMP_3X1]
J33  JUMP_3X1  [JUMP_3X1]
J34  JUMP_3X1  [JUMP_3X1]
J35  JUMP_3X1  [JUMP_3X1]
J36  JUMP_3X1  [JUMP_3X1]
Q51  2N7000  [TO92-DGS]
Q52  2N7000  [TO92-DGS]
Q53  2N7000  [TO92-DGS]
Q54  2N7000  [TO92-DGS]
Q55  2N7000  [TO92-DGS]
Q56  2N7000  [TO92-DGS]
Q57  2N7000  [TO92-DGS]
Q58  2N7000  [TO92-DGS]
Q59  2N7000  [TO92-DGS]
Q60  2N7000  [TO92-DGS]
R61  470  R_P2INCH  [R_P2INCH]
R62  470  R_P2INCH  [R_P2INCH]
R63  470  R_P2INCH  [R_P2INCH]
R64  10k  R_P2INCH  [R_P2INCH]
R65  10k  R_P2INCH  [R_P2INCH]
R66  10k  R_P2INCH  [R_P2INCH]
R67  470  R_P2INCH  [R_P2INCH]
R68  470  R_P2INCH  [R_P2INCH]
R69  470  R_P2INCH  [R_P2INCH]
R70  10k  R_P2INCH  [R_P2INCH]
R71  10k  R_P2INCH  [R_P2INCH]
R72  10k  R_P2INCH  [R_P2INCH]
R113  470  R_P2INCH  [R_P2INCH]
R114  470  R_P2INCH  [R_P2INCH]
R115  470  R_P2INCH  [R_P2INCH]
R116  470  R_P2INCH  [R_P2INCH]
R117  470  R_P2INCH  [R_P2INCH]
R118  470  R_P2INCH  [R_P2INCH]
R119  470  R_P2INCH  [R_P2INCH]
R120  470  R_P2INCH  [R_P2INCH]

### Nets
+5V: R64.2 R65.2 R66.2 R70.2 R71.2 R72.2 ; also sheet 1,2,3,4,5,7,8,9
D10: Q54.G ; also sheet 9
D11: Q59.G ; also sheet 9
DASH_EN_10: J32.2 Q52.G
DASH_EN_11: J35.2 Q57.G
EN_10: J31.1 Q55.D R65.1
EN_11: J34.1 Q60.D R71.1
EN_N_10: J32.1 J33.1 Q54.D Q55.G R64.1
EN_N_11: J35.1 J36.1 Q59.D Q60.G R70.1
GND: J32.3 J33.3 J35.3 J36.3 Q51.S Q52.S Q53.S Q54.S Q55.S Q56.S Q57.S Q58.S Q59.S Q60.S ; also sheet 1,2,3,4,5,7,8,9
LED_SUPPLY: D11.3(COM) D11.8(COM) D12.3(COM) D12.8(COM) ; also sheet 1,2,3,4,5,7,8,9
N$51: Q52.D R63.2
N$52: Q51.D R118.2 R119.2
N$53: D11.6(B) R119.1
N$54: D12.7(A) R116.1
N$55: J31.3 R66.1
N$56: D12.6(B) R115.1
N$57: D12.4(C) R114.1
N$58: D12.2(D) R113.1
N$59: D11.4(C) R118.1
N$60: J34.3 R72.1
N$106: D12.1(E) R67.1
N$107: D12.9(F) R68.1
N$108: D12.10(G) R69.1
N$109: Q58.D R67.2 R68.2 R113.2 R116.2
N$110: Q56.D R114.2 R115.2
N$111: Q57.D R69.2
N$112: D11.2(D) R117.1
N$113: D11.1(E) R61.1
N$114: D11.9(F) R62.1
N$115: D11.10(G) R63.1
N$116: D11.7(A) R120.1
N$117: Q53.D R61.2 R62.2 R117.2 R120.2
ONE_EN_10: J31.2 Q51.G
ONE_EN_11: J34.2 Q56.G
ZERO_EN_10: J33.2 Q53.G
ZERO_EN_11: J36.2 Q58.G
Unconnected: D11.5(DP) D12.5(DP)

## Sheet 7 of 9
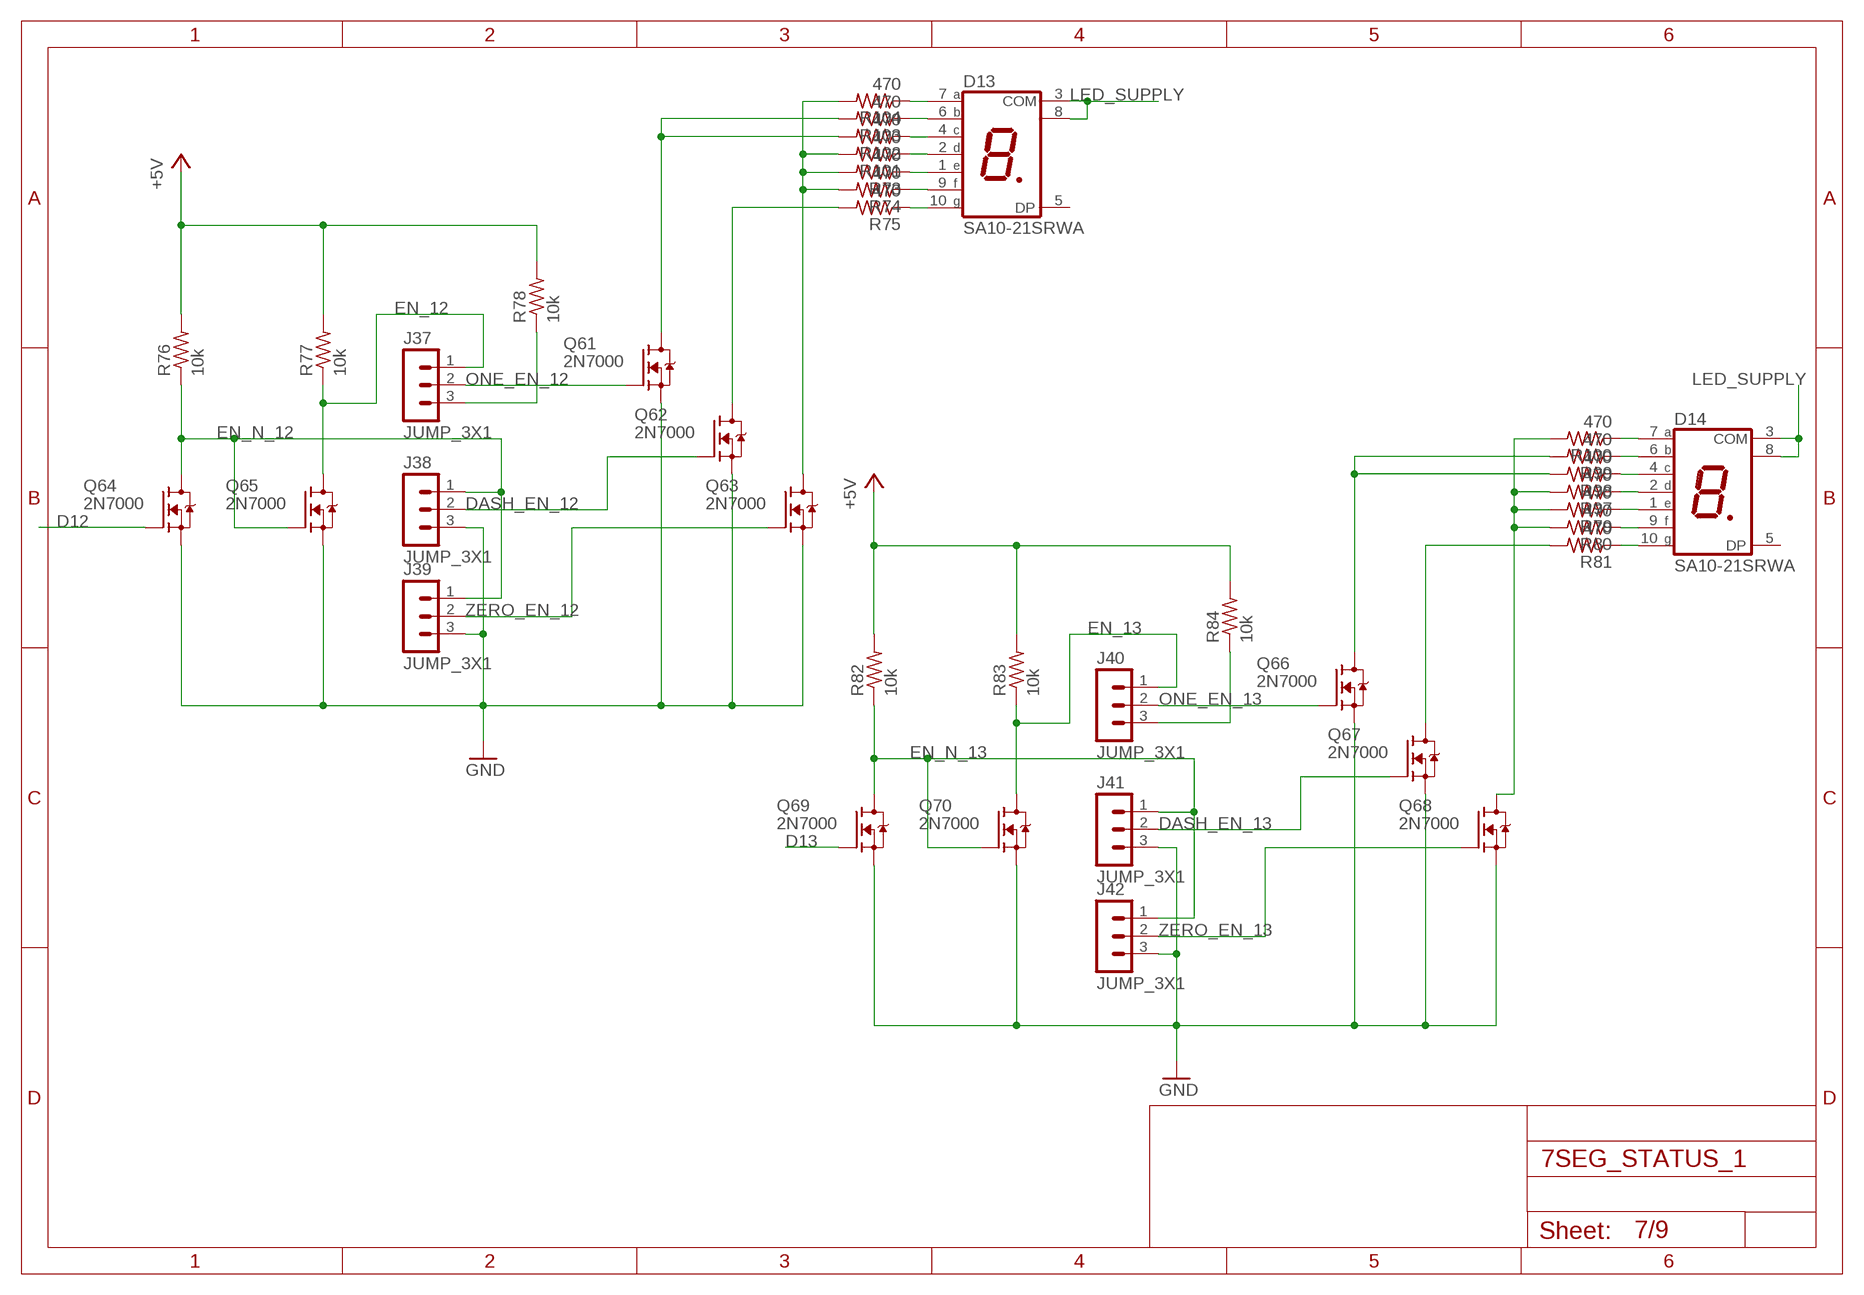
[diagram p6: schematic, sheet 7]

### Parts
D13  SA10-21SRWA  [SA10]
D14  SA10-21SRWA  [SA10]
J37  JUMP_3X1  [JUMP_3X1]
J38  JUMP_3X1  [JUMP_3X1]
J39  JUMP_3X1  [JUMP_3X1]
J40  JUMP_3X1  [JUMP_3X1]
J41  JUMP_3X1  [JUMP_3X1]
J42  JUMP_3X1  [JUMP_3X1]
Q61  2N7000  [TO92-DGS]
Q62  2N7000  [TO92-DGS]
Q63  2N7000  [TO92-DGS]
Q64  2N7000  [TO92-DGS]
Q65  2N7000  [TO92-DGS]
Q66  2N7000  [TO92-DGS]
Q67  2N7000  [TO92-DGS]
Q68  2N7000  [TO92-DGS]
Q69  2N7000  [TO92-DGS]
Q70  2N7000  [TO92-DGS]
R73  470  R_P2INCH  [R_P2INCH]
R74  470  R_P2INCH  [R_P2INCH]
R75  470  R_P2INCH  [R_P2INCH]
R76  10k  R_P2INCH  [R_P2INCH]
R77  10k  R_P2INCH  [R_P2INCH]
R78  10k  R_P2INCH  [R_P2INCH]
R79  470  R_P2INCH  [R_P2INCH]
R80  470  R_P2INCH  [R_P2INCH]
R81  470  R_P2INCH  [R_P2INCH]
R82  10k  R_P2INCH  [R_P2INCH]
R83  10k  R_P2INCH  [R_P2INCH]
R84  10k  R_P2INCH  [R_P2INCH]
R97  470  R_P2INCH  [R_P2INCH]
R98  470  R_P2INCH  [R_P2INCH]
R99  470  R_P2INCH  [R_P2INCH]
R100  470  R_P2INCH  [R_P2INCH]
R101  470  R_P2INCH  [R_P2INCH]
R102  470  R_P2INCH  [R_P2INCH]
R103  470  R_P2INCH  [R_P2INCH]
R104  470  R_P2INCH  [R_P2INCH]

### Nets
+5V: R76.2 R77.2 R78.2 R82.2 R83.2 R84.2 ; also sheet 1,2,3,4,5,6,8,9
D12: Q64.G ; also sheet 9
D13: Q69.G ; also sheet 9
DASH_EN_12: J38.2 Q62.G
DASH_EN_13: J41.2 Q67.G
EN_12: J37.1 Q65.D R77.1
EN_13: J40.1 Q70.D R83.1
EN_N_12: J38.1 J39.1 Q64.D Q65.G R76.1
EN_N_13: J41.1 J42.1 Q69.D Q70.G R82.1
GND: J38.3 J39.3 J41.3 J42.3 Q61.S Q62.S Q63.S Q64.S Q65.S Q66.S Q67.S Q68.S Q69.S Q70.S ; also sheet 1,2,3,4,5,6,8,9
LED_SUPPLY: D13.3(COM) D13.8(COM) D14.3(COM) D14.8(COM) ; also sheet 1,2,3,4,5,6,8,9
N$61: D13.10(G) R75.1
N$62: D13.9(F) R74.1
N$63: D13.1(E) R73.1
N$64: D13.2(D) R101.1
N$65: J37.3 R78.1
N$66: D14.7(A) R100.1
N$67: D14.6(B) R99.1
N$68: D14.4(C) R98.1
N$69: D14.2(D) R97.1
N$70: J40.3 R84.1
N$74: D14.1(E) R79.1
N$81: D14.9(F) R80.1
N$87: D14.10(G) R81.1
N$88: D13.4(C) R102.1
N$89: Q66.D R98.2 R99.2
N$90: D13.6(B) R103.1
N$91: Q67.D R81.2
N$92: Q68.D R79.2 R80.2 R97.2 R100.2
N$93: D13.7(A) R104.1
N$94: Q62.D R75.2
N$95: Q61.D R102.2 R103.2
N$96: Q63.D R73.2 R74.2 R101.2 R104.2
ONE_EN_12: J37.2 Q61.G
ONE_EN_13: J40.2 Q66.G
ZERO_EN_12: J39.2 Q63.G
ZERO_EN_13: J42.2 Q68.G
Unconnected: D13.5(DP) D14.5(DP)

## Sheet 8 of 9
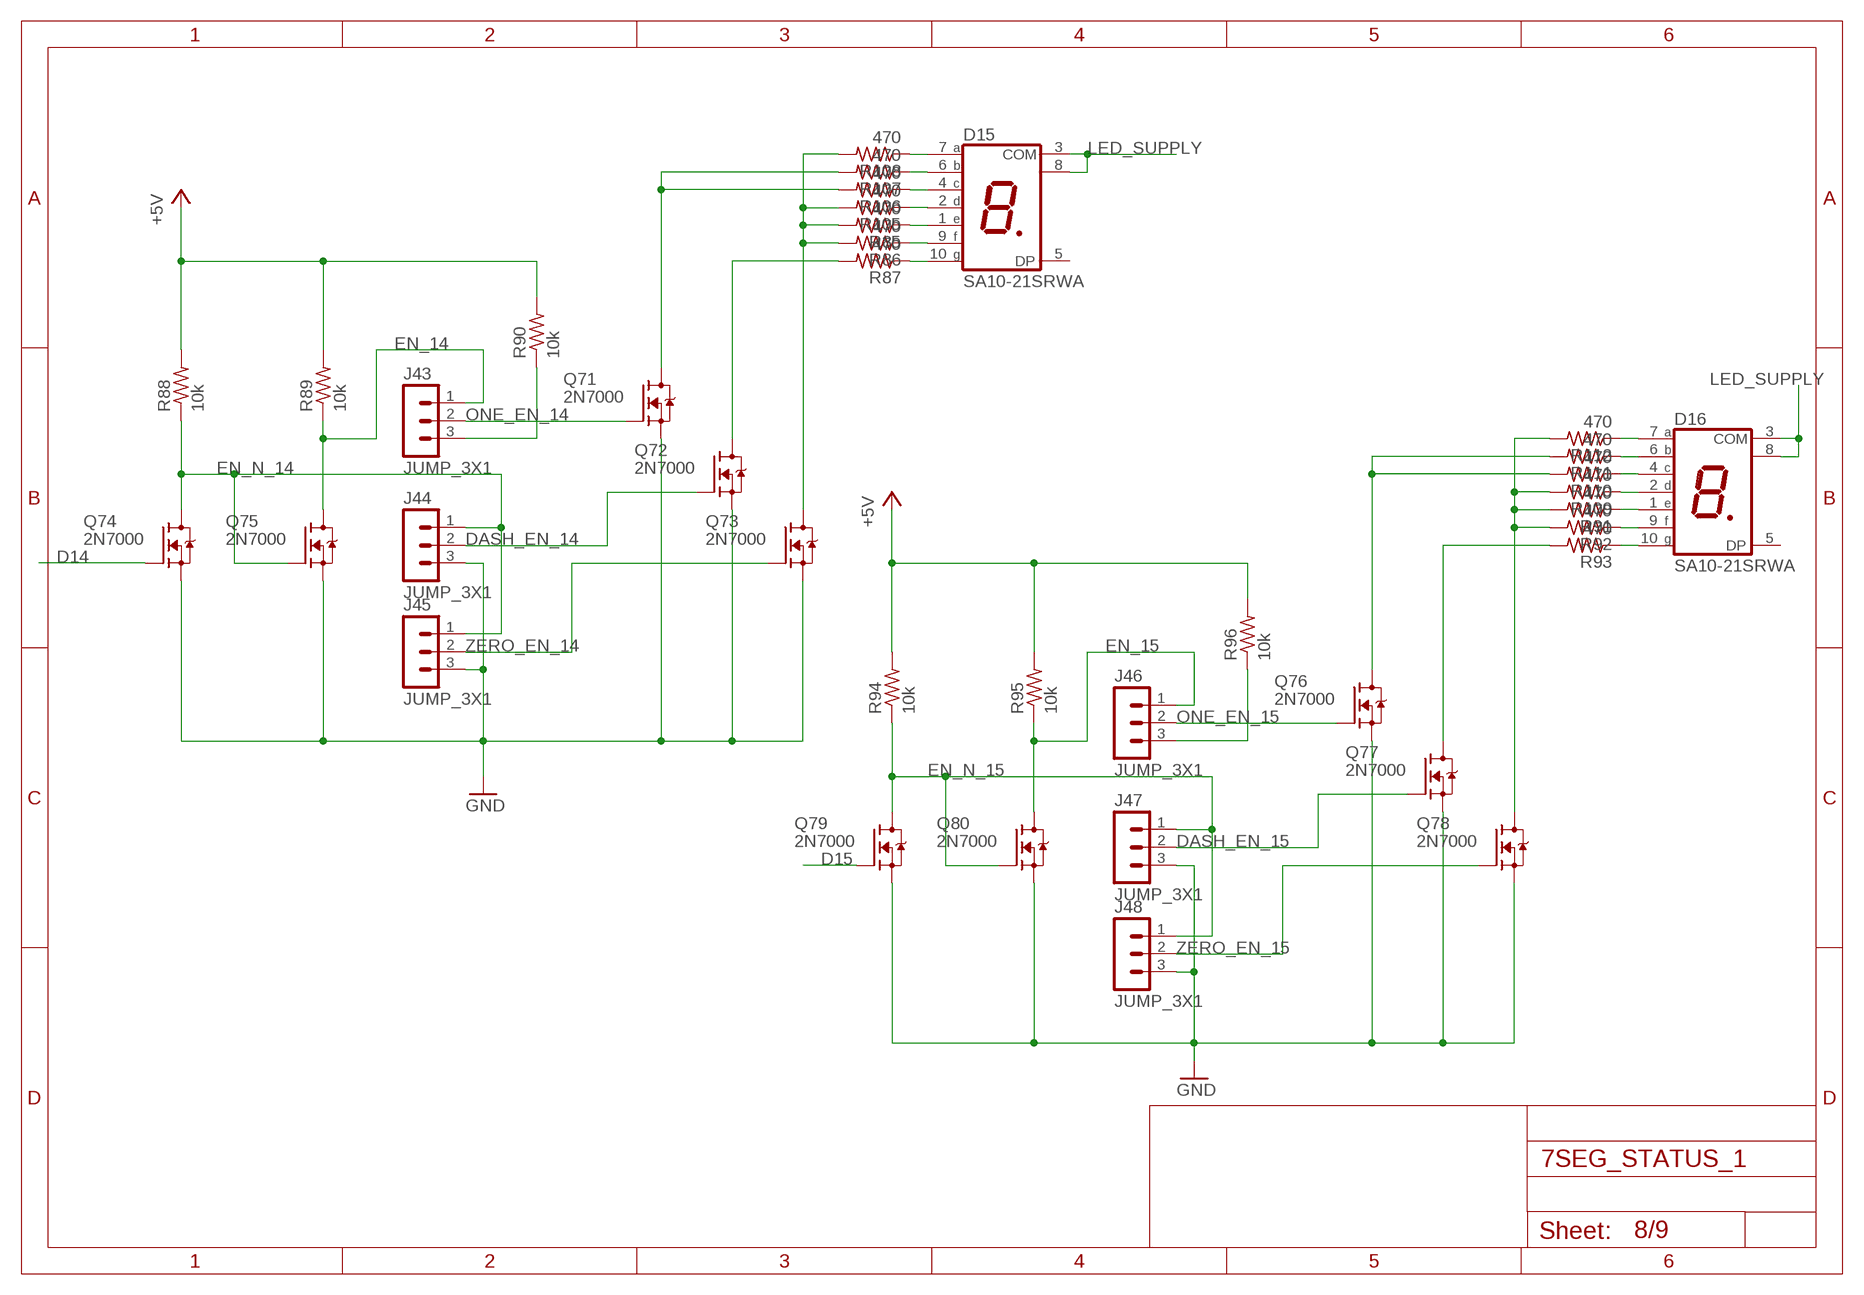
[diagram p7: schematic, sheet 8]

### Parts
D15  SA10-21SRWA  [SA10]
D16  SA10-21SRWA  [SA10]
J43  JUMP_3X1  [JUMP_3X1]
J44  JUMP_3X1  [JUMP_3X1]
J45  JUMP_3X1  [JUMP_3X1]
J46  JUMP_3X1  [JUMP_3X1]
J47  JUMP_3X1  [JUMP_3X1]
J48  JUMP_3X1  [JUMP_3X1]
Q71  2N7000  [TO92-DGS]
Q72  2N7000  [TO92-DGS]
Q73  2N7000  [TO92-DGS]
Q74  2N7000  [TO92-DGS]
Q75  2N7000  [TO92-DGS]
Q76  2N7000  [TO92-DGS]
Q77  2N7000  [TO92-DGS]
Q78  2N7000  [TO92-DGS]
Q79  2N7000  [TO92-DGS]
Q80  2N7000  [TO92-DGS]
R85  470  R_P2INCH  [R_P2INCH]
R86  470  R_P2INCH  [R_P2INCH]
R87  470  R_P2INCH  [R_P2INCH]
R88  10k  R_P2INCH  [R_P2INCH]
R89  10k  R_P2INCH  [R_P2INCH]
R90  10k  R_P2INCH  [R_P2INCH]
R91  470  R_P2INCH  [R_P2INCH]
R92  470  R_P2INCH  [R_P2INCH]
R93  470  R_P2INCH  [R_P2INCH]
R94  10k  R_P2INCH  [R_P2INCH]
R95  10k  R_P2INCH  [R_P2INCH]
R96  10k  R_P2INCH  [R_P2INCH]
R105  470  R_P2INCH  [R_P2INCH]
R106  470  R_P2INCH  [R_P2INCH]
R107  470  R_P2INCH  [R_P2INCH]
R108  470  R_P2INCH  [R_P2INCH]
R109  470  R_P2INCH  [R_P2INCH]
R110  470  R_P2INCH  [R_P2INCH]
R111  470  R_P2INCH  [R_P2INCH]
R112  470  R_P2INCH  [R_P2INCH]

### Nets
+5V: R88.2 R89.2 R90.2 R94.2 R95.2 R96.2 ; also sheet 1,2,3,4,5,6,7,9
D14: Q74.G ; also sheet 9
D15: Q79.G ; also sheet 9
DASH_EN_14: J44.2 Q72.G
DASH_EN_15: J47.2 Q77.G
EN_14: J43.1 Q75.D R89.1
EN_15: J46.1 Q80.D R95.1
EN_N_14: J44.1 J45.1 Q74.D Q75.G R88.1
EN_N_15: J47.1 J48.1 Q79.D Q80.G R94.1
GND: J44.3 J45.3 J47.3 J48.3 Q71.S Q72.S Q73.S Q74.S Q75.S Q76.S Q77.S Q78.S Q79.S Q80.S ; also sheet 1,2,3,4,5,6,7,9
LED_SUPPLY: D15.3(COM) D15.8(COM) D16.3(COM) D16.8(COM) ; also sheet 1,2,3,4,5,6,7,9
N$71: D15.10(G) R87.1
N$72: D15.9(F) R86.1
N$73: D15.1(E) R85.1
N$75: J43.3 R90.1
N$76: D16.10(G) R93.1
N$77: D16.9(F) R92.1
N$78: D16.1(E) R91.1
N$79: D16.2(D) R109.1
N$80: J46.3 R96.1
N$82: D16.4(C) R110.1
N$83: D16.6(B) R111.1
N$84: D15.2(D) R105.1
N$85: D15.4(C) R106.1
N$86: D15.6(B) R107.1
N$97: D15.7(A) R108.1
N$98: Q72.D R87.2
N$99: Q71.D R106.2 R107.2
N$100: Q73.D R85.2 R86.2 R105.2 R108.2
N$101: D16.7(A) R112.1
N$102: Q77.D R93.2
N$103: Q76.D R110.2 R111.2
N$104: Q78.D R91.2 R92.2 R109.2 R112.2
ONE_EN_14: J43.2 Q71.G
ONE_EN_15: J46.2 Q76.G
ZERO_EN_14: J45.2 Q73.G
ZERO_EN_15: J48.2 Q78.G
Unconnected: D15.5(DP) D16.5(DP)

## Sheet 9 of 9
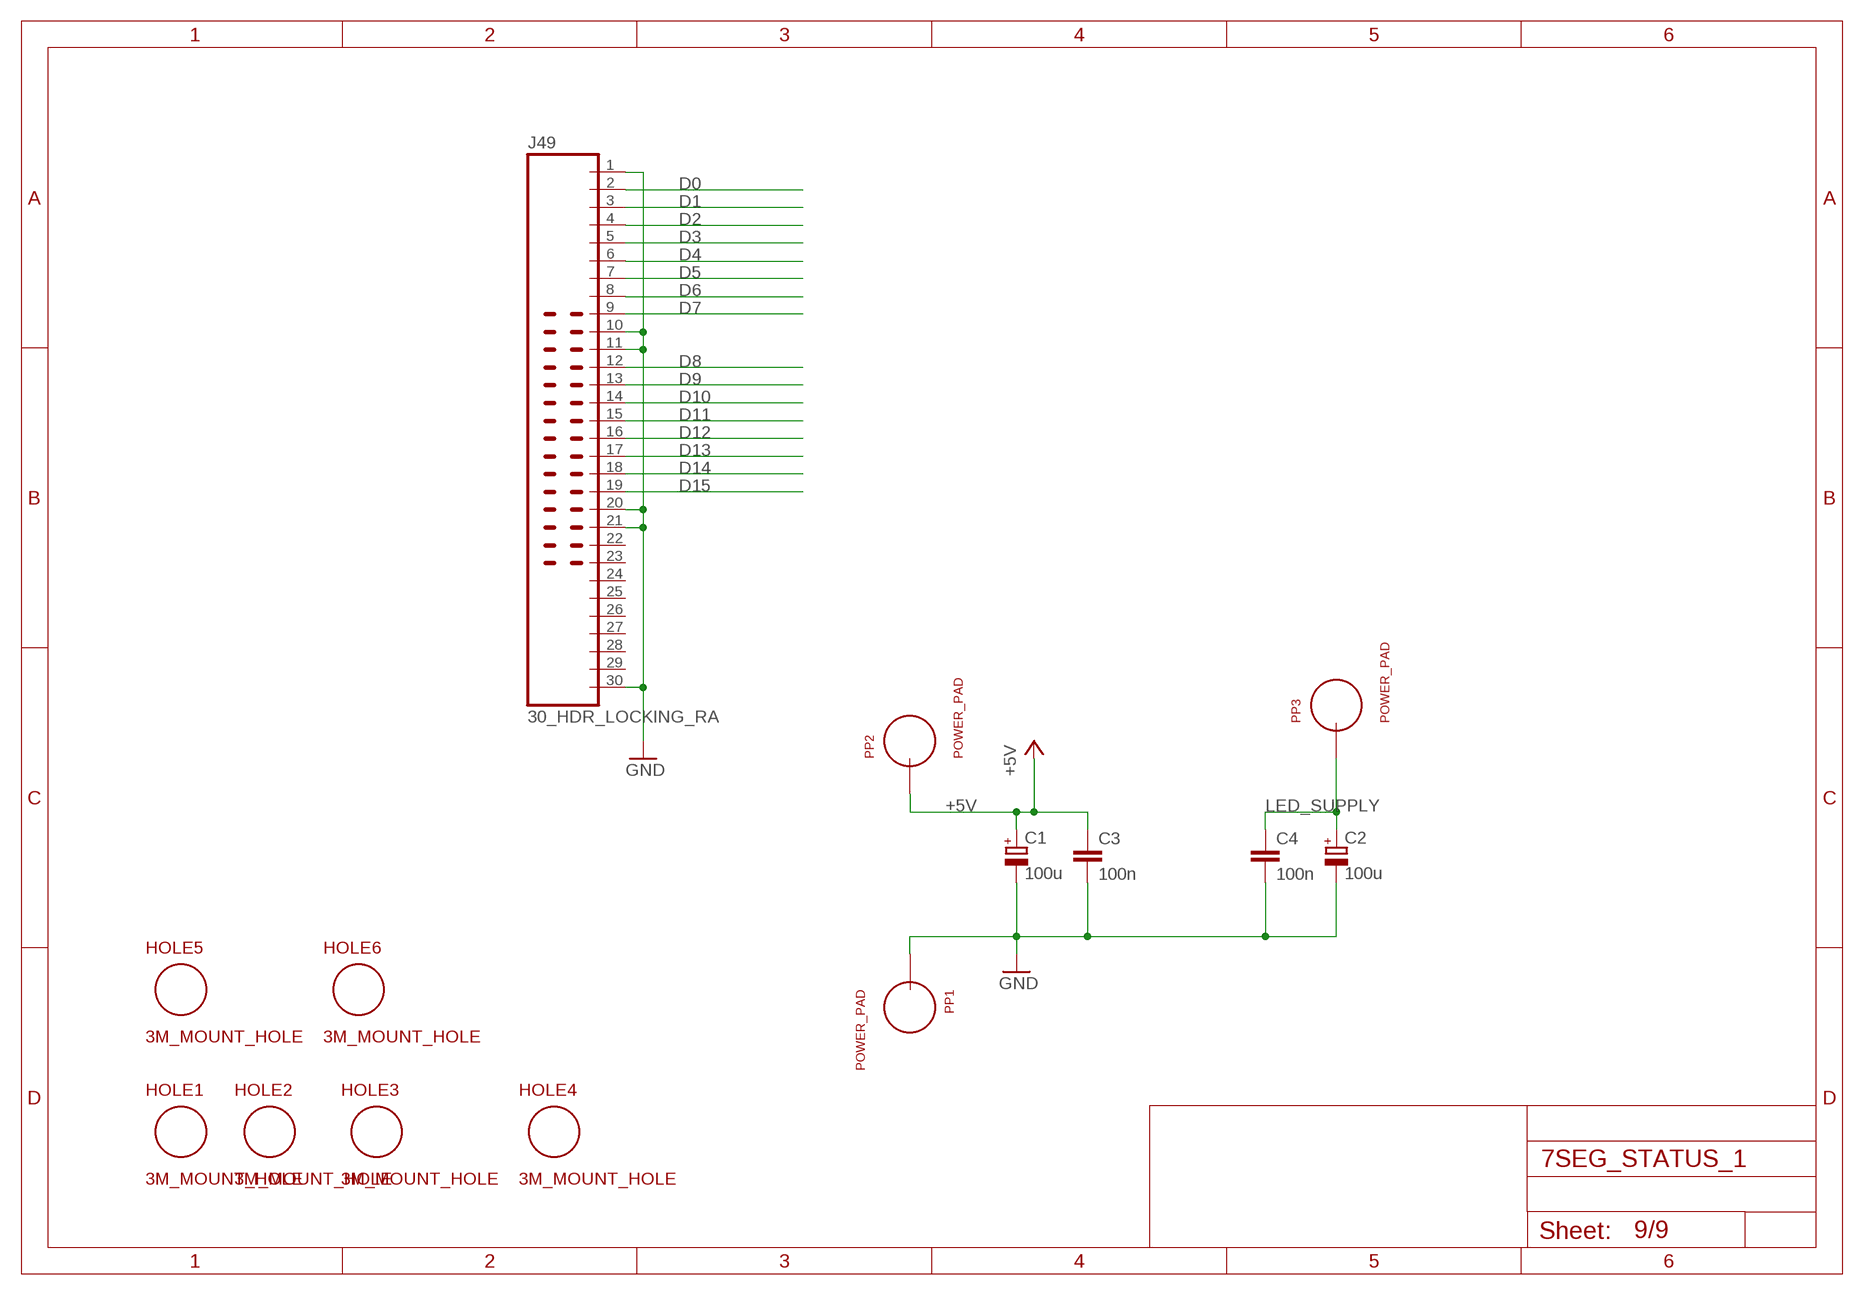
[diagram p8: schematic, sheet 9]

### Parts
C1  100u  POLARISED_CAP_2P5_6P3MM  [POLARISED_CAP_2P5_6P3MM]
C2  100u  POLARISED_CAP_2P5_6P3MM  [POLARISED_CAP_2P5_6P3MM]
C3  100n  C_P2INCH  [CAP_P2INCH]
C4  100n  C_P2INCH  [CAP_P2INCH]
HOLE1  3M_MOUNT_HOLE  [3M_HOLE]
HOLE2  3M_MOUNT_HOLE  [3M_HOLE]
HOLE3  3M_MOUNT_HOLE  [3M_HOLE]
HOLE4  3M_MOUNT_HOLE  [3M_HOLE]
HOLE5  3M_MOUNT_HOLE  [3M_HOLE]
HOLE6  3M_MOUNT_HOLE  [3M_HOLE]
J49  30_HDR_LOCKING_RA  [30_HDR_LOCKING_RA]
PP1  POWER_PAD  [POWER_PAD]
PP2  POWER_PAD  [POWER_PAD]
PP3  POWER_PAD  [POWER_PAD]

### Nets
+5V: C1.A C3.1 PP2.1 ; also sheet 1,2,3,4,5,6,7,8
D0: J49.2 ; also sheet 1
D1: J49.3 ; also sheet 1
D2: J49.4 ; also sheet 2
D3: J49.5 ; also sheet 2
D4: J49.6 ; also sheet 3
D5: J49.7 ; also sheet 3
D6: J49.8 ; also sheet 4
D7: J49.9 ; also sheet 4
D8: J49.12 ; also sheet 5
D9: J49.13 ; also sheet 5
D10: J49.14 ; also sheet 6
D11: J49.15 ; also sheet 6
D12: J49.16 ; also sheet 7
D13: J49.17 ; also sheet 7
D14: J49.18 ; also sheet 8
D15: J49.19 ; also sheet 8
GND: C1.K C2.K C3.2 C4.2 J49.1 J49.10 J49.11 J49.20 J49.21 J49.30 PP1.1 ; also sheet 1,2,3,4,5,6,7,8
LED_SUPPLY: C2.A C4.1 PP3.1 ; also sheet 1,2,3,4,5,6,7,8
Unconnected: J49.22 J49.23 J49.24 J49.25 J49.26 J49.27 J49.28 J49.29

## Library data of the parts
C1 C2 = MyLib:POLARISED_CAP_2P5_6P3MM
C3 C4 = MyLib:C_P2INCH
D1-D16 = MyLib:SA10-21SRWA
HOLE1-HOLE6 = MyLib:3M_MOUNT_HOLE
J1-J48 = MyLib:JUMP_3X1
J49 = MyLib:30_HDR_LOCKING_RA
PP1-PP3 = MyLib:POWER_PAD
Q1-Q80 = MyLib:2N7000
R1-R160 = MyLib:R_P2INCH